# EAGLE design watch super (EAGLE 9.6.2)
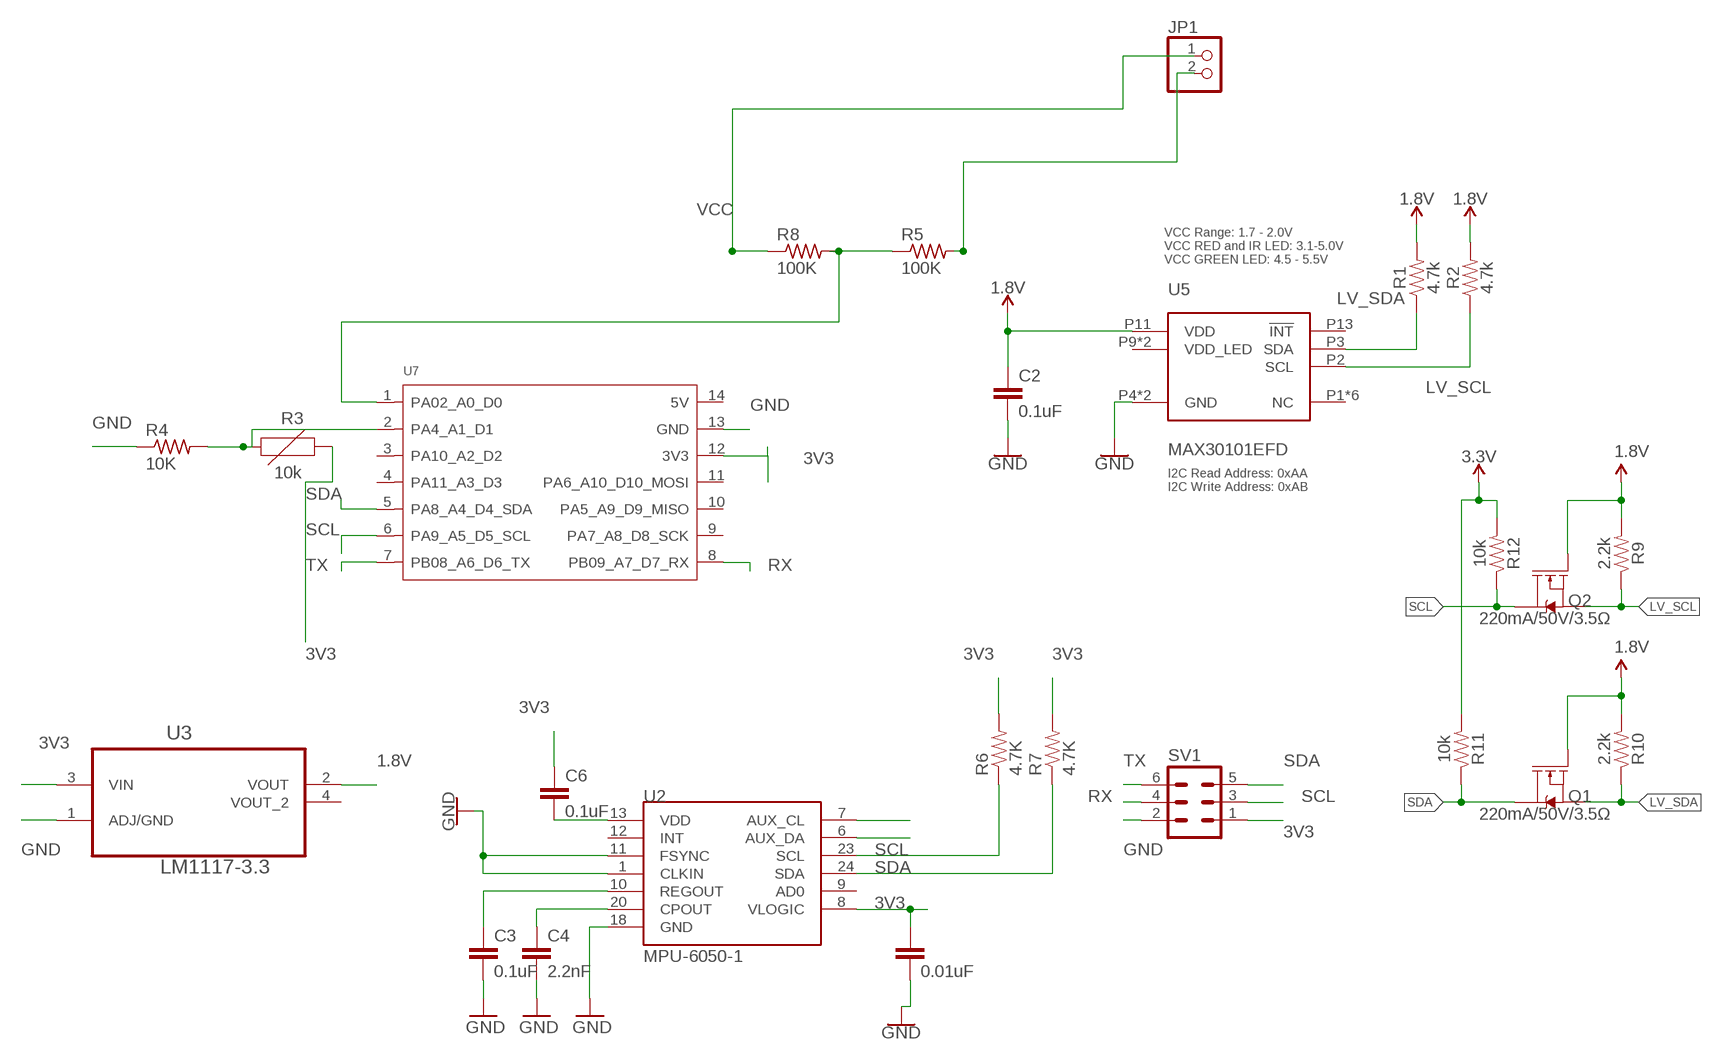
[diagram p0: schematic, sheet 1]

## Parts
0.01UF  0.01uF  CAP0603-CAP  [0603-CAP]
C2  0.1uF  0.1UF-0402-16V-10%  [0402]
C3  0.1uF  CAP0603-CAP  [0603-CAP]
C4  2.2nF  CAP0603-CAP  [0603-CAP]
C6  0.1uF  CAP0603-CAP  [0603-CAP]
JP1  PINHD-1X2  [1X02]
Q1  220mA/50V/3.5Ω  MOSFET-NCH-BSS138  [SOT23-3]
Q2  220mA/50V/3.5Ω  MOSFET-NCH-BSS138  [SOT23-3]
R1  4.7k  4.7KOHM-0603-1/10W-1%  [0603]
R2  4.7k  4.7KOHM-0603-1/10W-1%  [0603]
R3  10k  NTC-THERMISTOR-0603  [0603@1]
R4  10K  R-US_M1206  [M1206]
R5  100K  R-US_R0603  [R0603]
R6  4.7K  RESISTOR0603-RES  [0603-RES]
R7  4.7K  RESISTOR0603-RES  [0603-RES]
R8  100K  R-US_R0603  [R0603]
R9  2.2k  2.2KOHM-0603-1/10W-1%  [0603]
R10  2.2k  2.2KOHM-0603-1/10W-1%  [0603]
R11  10k  10KOHM-0603-1/10W-1%  [0603]
R12  10k  10KOHM-0603-1/10W-1%  [0603]
SV1  MA03-2  [MA03-2]
U2  MPU-6050-1  [QFN-24-4MM2]
U3  LM1117-3.3  [SOT230]
U5  MAX30101EFD  [14_PIN_OESIP]
U7  SEEEDUINOTHT  [MOUDLE14P-2.54-21X17.8MM]

## Nets
1.8V: C2.1 Q1.1(G) Q2.1(G) R1.2 R2.2 R9.2 R10.2 U3.2(VOUT) U5.P11(VDD)
3.3V: R11.2 R12.2
3V3: 0.01UF.1 C6.1 R3.2 R6.2 R7.2 SV1.1 U2.8(VLOGIC) U3.3(VIN) U7.12(3V3)
AUX_SCL: U2.7(AUX_CL)
AUX_SDA: U2.6(AUX_DA)
GND: 0.01UF.2 C2.2 C3.2 C4.2 R4.1 SV1.2 U2.1(CLKIN) U2.11(FSYNC) U2.18(GND) U3.1(ADJ/GND) U5.P4(GND) U5.P12(GND) U7.13(GND)
LV_SCL: Q2.2(S) R2.1 R9.1 U5.P2(SCL)
LV_SDA: Q1.2(S) R1.1 R10.1 U5.P3(SDA)
N$2 [New Class]: R3.1 R4.2 U7.2(PA4_A1_D1)
N$3: JP1.2 R5.2
N$4: C4.1 U2.20(CPOUT)
N$5: C3.1 U2.10(REGOUT)
N$7: C6.2 U2.13(VDD)
N$9: R5.1 R8.2 U7.1(PA02_A0_D0)
RX: SV1.4 U7.8(PB09_A7_D7_RX)
SCL: Q2.3(D) R6.1 R12.1 SV1.3 U2.23(SCL) U7.6(PA9_A5_D5_SCL)
SDA: Q1.3(D) R7.1 R11.1 SV1.5 U2.24(SDA) U7.5(PA8_A4_D4_SDA)
TX: SV1.6 U7.7(PB08_A6_D6_TX)
VCC: JP1.1 R8.1
Unconnected: U2.9(AD0) U2.12(INT) U3.4(VOUT_2) U5.P1(NC) U5.P5(NC) U5.P6(NC) U5.P7(NC) U5.P8(NC) U5.P13(!INT) U5.P14(NC) U7.3(PA10_A2_D2) U7.4(PA11_A3_D3) U7.9(PA7_A8_D8_SCK) U7.10(PA5_A9_D9_MISO) U7.11(PA6_A10_D10_MOSI) U7.14(5V)

## Notes on the sheet
- VCC Range: 1.7 - 2.0V
  VCC RED and IR LED: 3.1-5.0V
  VCC GREEN LED: 4.5 - 5.5V
- I2C Read Address: 0xAA
  I2C Write Address: 0xAB

## Power pins joined to a net without a drawn wire
VDD_LED: U5.P9(VDD_LED) U5.P10(VDD_LED)

## Library data of the parts
0.01UF C3 C4 C6 = SparkFun:CAP: Capacitor Standard 0603 ceramic capacitor, and 0.1" leaded capacitor.
C2 = SparkFun-Capacitors:0.1UF: 0.1µF ceramic capacitors A capacitor is a passive two-terminal electrical component used to store electrical energy temporarily in an electric field.; PROD_ID: CAP-12416
JP1 = pinhead:PINHD-1X2: PIN HEADER
Q1 Q2 = SparkFun-DiscreteSemi:MOSFET-NCH: N-channel MOSFETs Voltage controlled devices that allow control of high current outputs. SparkFun Products: SparkFun OpenScale <https://www.sparkfun.com/products/13261> SparkFun Digital Sandbox <https://www.sparkfun.com/products/12651> SparkFun Monster Moto Shield <https://www.sparkfun.com/products/10182> SparkFun MOSFET Power Controller <https://www.sparkfun.com/products/11214>; PROD_ID: TRANS-00830
R1 R2 = SparkFun-Resistors:4.7KOHM: 4.7kΩ resistor A resistor is a passive two-terminal electrical component that implements electrical resistance as a circuit element. Resistors act to reduce current flow, and, at the same time, act to lower voltage levels within circuits. - Wikipedia; PROD_ID: RES-07857
R3 = SparkFun-Resistors:NTC-THERMISTOR: NTC Thermistor An NTC thermistor's resistance decreases as temperature rises. Applications: Resistance Thermometer - temperature monitoring Inrush current limiter Heat source; PROD_ID: RES-13608
R4 = adafruit:R-US_: RESISTOR, American symbol
R5 R8 = rcl:R-US_: RESISTOR, American symbol; SPICEPREFIX: R
R6 R7 = SparkFun:RESISTOR: Resistor Basic schematic elements and footprints for 0603, 1206, and PTH resistors.
R9 R10 = SparkFun-Resistors:2.2KOHM: 2.2kΩ resistor A resistor is a passive two-terminal electrical component that implements electrical resistance as a circuit element. Resistors act to reduce current flow, and, at the same time, act to lower voltage levels within circuits. - Wikipedia; PROD_ID: RES-08272
R11 R12 = SparkFun-Resistors:10KOHM: 10kΩ resistor A resistor is a passive two-terminal electrical component that implements electrical resistance as a circuit element. Resistors act to reduce current flow, and, at the same time, act to lower voltage levels within circuits. - Wikipedia; PROD_ID: RES-00824
SV1 = con-lstb:MA03-2: PIN HEADER; OC_FARNELL: unknown; OC_NEWARK: unknown
U2 = Testing:MPU-6050
U3 = LM1117-3.3:LM1117-3.3: IC REG LDO 800MA 3.3V Check availability <https://pricing.snapeda.com/parts/LM1117-3.3/Texas%20Instruments/view-part?ref=eda>; AVAILABILITY: Not in stock; CHECK_PRICES: https://www.snapeda.com/parts/LM1117-3.3/Texas+Instruments/view-part/?ref=eda; DESCRIPTION: Linear Voltage Regulator IC Positive Fixed 1 Output 800mA DDPAK/TO-263-3; MF: Texas Instruments; MP: LM1117-3.3; PACKAGE: None; PRICE: None; SNAPEDA_LINK: https://www.snapeda.com/parts/LM1117-3.3/Texas+Instruments/view-part/?ref=snap
U5 = SparkFun-IC-Special-Function:MAX30101EFD: MAX30101 High-Sensitivity Pulse Oximeter and Heart-Rate Sensor The MAX30101 is an integrated pulse oximetry and heart-rate monitor module. It includes internal LEDs, photodetectors, optical elements, and low-noise electronics with ambient light rejection. The MAX30101 provides a complete system solution to ease the design-in process for mobile and wearable devices. The MAX30101 operates on a single 1.8V power supply and a separate 5.0V power supply for the internal LEDs. Communication is through a standard I2C-compatible interface. The module can be shut down through software with zero standby current, allowing the power rails to remain powered at all times; PROD_ID: IC-14270
U7 = Seeed-Studio-XIAO-ESP32C3-footprint-eagle:SEEEDUINOTHT

## Net classes
1 New Class: width 0.015 mm

## Board
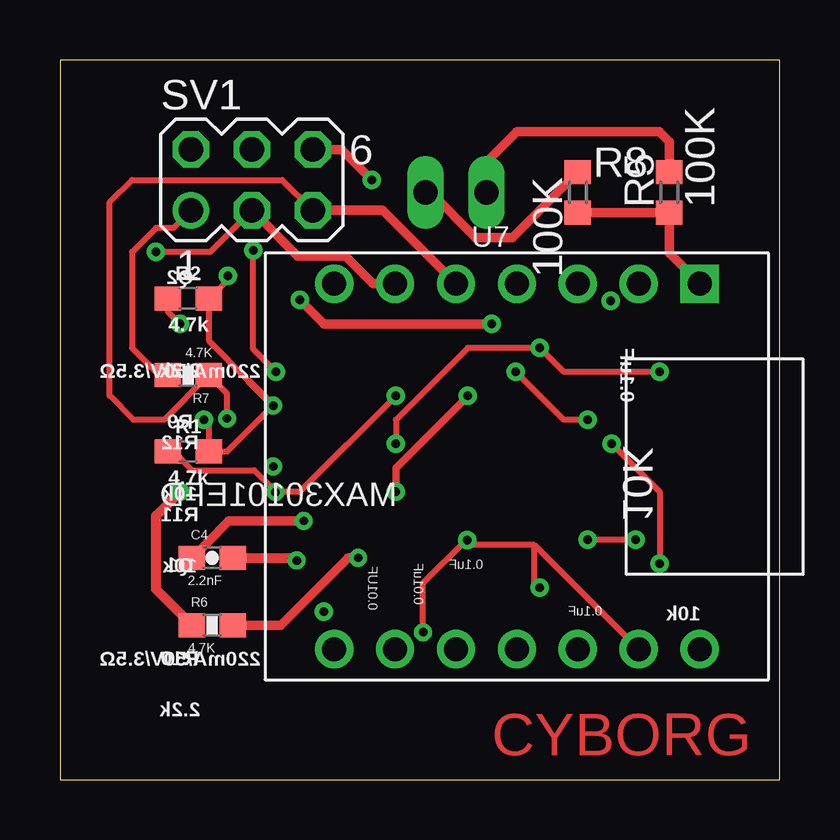
[diagram p1: board, top side]
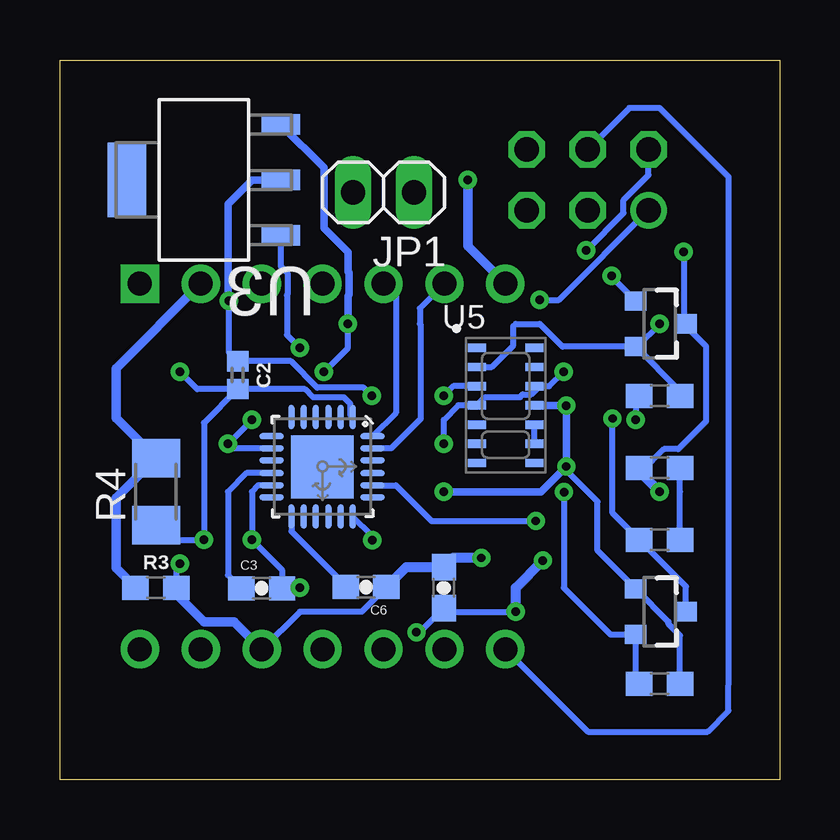
[diagram p2: board, bottom side, seen from below]

Size 30 x 30 mm. Coordinates in mm from the lower left corner, seen from the top.
Outline: 0,0 30,0 30,30 0,30 0,0
Copper layers (1*16): Top 0.035mm / dielectric 1.5mm / Bottom 0.035mm
Design rules "default": minimum track width 6mil, minimum drill 0.35mm, track to track 6mil, track to pad 6mil, pad to pad 6mil, via to via 6mil, smd to smd 6mil, copper to edge 40mil, drill to drill 6mil, minimum pad ring 10mil, minimum via ring 8mil, stop-mask expansion 4mil, vias tented up to drill 0mil, thermal gap 10mil

### Footprints (pad centres in the part's own frame; a part is rotated, then mirrored left to right if it is on the bottom)
0603-CAP = smd 1.1 x 1: 1 -0.85,0; 2 0.85,0
0402 = smd 0.85 x 0.9: 1 -0.58,0; 2 0.58,0
1X02 = drill 1.016 long: 1 -1.27,0; 2 1.27,0
SOT23-3 = smd 0.8 x 0.9: 1 -0.95,-1; 2 0.95,-1; 3 0,1.1
0603 = smd 1.1 x 1: 1 -0.85,0; 2 0.85,0
0603@1 = smd 1.1 x 1: 1 -0.85,0; 2 0.85,0
M1206 = smd 1.6 x 2: 1 -1.4,0; 2 1.4,0
R0603 = smd 1 x 1.1: 1 -0.85,0; 2 0.85,0
0603-RES = smd 1.1 x 1: 1 -0.85,0; 2 0.85,0
MA03-2 = drill 1.016: 1 -2.54,-1.27 | drill 1.016 octagon: 2 -2.54,1.27; 3 0,-1.27; 4 0,1.27; 5 2.54,-1.27; 6 2.54,1.27
QFN-24-4MM2 = smd 1.016 x 0.254: 1 -2.066,1.257; 2 -2.066,0.75; 3 -2.066,0.247; 4 -2.066,-0.287; 5 -2.066,-0.792; 6 -2.066,-1.297; 13 2.086,-1.297; 14 2.086,-0.792; 15 2.086,-0.287; 16 2.086,0.247; 17 2.086,0.75; 18 2.086,1.257 | smd 0.254 x 1.016: 7 -1.267,-2.122; 8 -0.762,-2.122; 9 -0.258,-2.122; 10 0.278,-2.122; 11 0.78,-2.122; 12 1.287,-2.122; 19 1.287,2.082; 20 0.78,2.082; 21 0.278,2.082; 22 -0.258,2.082; 23 -0.762,2.082; 24 -1.267,2.082 | smd 2.616 x 2.616: P$1 0.02,-0.01
SOT230 = smd 1.6 x 0.838: 1 -3.2,2.311; 2 -3.2,0; 3 -3.2,-2.311 | smd 1.6 x 3.099: 4 3.2,0
14_PIN_OESIP = smd 0.75 x 0.35: P1 -1.193,2.409; P2 -1.193,1.609; P3 -1.193,0.809; P4 -1.193,0.009; P5 -1.193,-0.791; P6 -1.193,-1.591; P7 -1.193,-2.391; P8 1.207,-2.391; P9 1.207,-1.591; P10 1.207,-0.791; P11 1.207,0.009; P12 1.207,0.809; P13 1.207,1.609; P14 1.207,2.409
MOUDLE14P-2.54-21X17.8MM = drill 1 pad 1.6 square: 1 7.62,7.62 | drill 1 pad 1.6: 2 5.08,7.62; 3 2.54,7.62; 4 0,7.62; 5 -2.54,7.62; 6 -5.08,7.62; 7 -7.62,7.62; 8 -7.62,-7.62; 9 -5.08,-7.62; 10 -2.54,-7.62; 11 0,-7.62; 12 2.54,-7.62; 13 5.08,-7.62; 14 7.62,-7.62

### Placement (x,y rotation side)
0.01UF  14,8 270 bottom
C2  22.59,16.86 270 bottom
C3  21.59,7.97 0 bottom
C4  6.35,9.24 0 top
C6  17.24,8.03 180 bottom
JP1  16.51,24.48 180 bottom
Q1  5,7 270 bottom
Q2  5,19 270 bottom
R1  5.35,13.67 0 top
R2  5.35,20.05 0 top
R3  26,8 0 bottom
R4  26,12 90 bottom
R5  25.4,24.48 90 top
R6  6.35,6.43 0 top
R7  5.35,16.86 180 top
R8  21.59,24.48 270 top
R9  5,16 180 bottom
R10  5,4 0 bottom
R11  5,10 0 bottom
R12  5,13 0 bottom
SV1  8,25 0 top
U2  19.05,13.05 270 bottom
U3  24,25 180 bottom
U5  11.43,15.59 0 bottom
U7  19.05,13.05 0 top

### Tracks (layer width: path | path; a pad name or v marks a point on that pad's centre or on a via)
1.8V  (via drill 0.35)
  Top 0.254: 7.89,16.59 7.03,17.45 7.03,17.48 6.2,18.3 R2.2 7,20.85 v7,21 | v8.89,15.59 6.97,13.67 R1.2 6.2,14.8 v6,15
  Top 0.305: v17,16 14,13 v14,12 | 7.89,16.59 v8.89,15.59
  Bottom 0.254: R10.2 4.15,6.01 4.63,6.48 4.63,6.58 Q1.1 7.59,9.54 7.59,11.59 8.97,12.97 | Q2.1 7,20.95 v7,21 | R9.2 6,15.85 v6,15 | v17,16 17.34,16.34 19.27,16.34 20.37,17.44 C2.1 22.96,17.81 v22.96,19.96
  Bottom 0.305: U3.2 22,25 23,24 23,20 v22.96,19.96 | v14,12 9.94,12 8.97,12.97 v8.89,13.05 v8.89,15.59 | v8.9,15.6 U5.P11
  Bottom 0.4: v8.89,15.59 v8.9,15.6
3.3V
  Bottom 0.254: R11.2 4.15,12 R12.2
3V3  (via drill 0.35)
  Top 0.254: SV1.1 4.73,23 4,23 3,22 3,18 4.14,16.86 R7.2 | v23,14 25,12 v25,9 | v22,15 21,15 v19,17
  Top 0.4: v12.43,9.24 12.01,9.24 9.2,6.43 R6.2 | v18,19 11,19 v10,20 | SV1.1 5.46,23.46
  Bottom 0.254: C6.1 17.42,7 20,7 21.57,5.43 U7.12 | v10,20 9.19,20 SV1.1 | U2.8 22.81,13.81 v23,14 v22,15 | v25,9 25.15,8.85 R3.2 | v19,17 18,18 v18,19
  Bottom 0.305: v18,19 18,20.16 17.95,20.21 17.95,21.13 18,21.18 18,22 19,23 19,25.51 U3.3
  Bottom 0.4: U7.12 22.74,6.58 24,6.58 25.15,7.73 R3.2
  Bottom 0.406: v12.43,9.24 13.61,9.24 0.01UF.1 15.57,8.85 C6.1
  other vias: 21.59,5.43 5.46,23.73
GND  (via drill 0.35)
  Top 0.254: v24,10 v22,10 | 19.78,9.78 U7.13 | v25,17 21,17 v20,18 17,18 14,15 v14,14 | v9,17 8.06,17.94 v8.06,22.06 | 16.95,10 15.14,8.19 v15.14,6.14 | 19.78,9.78 17.17,9.78 v16.98,9.98 | v20,8 19.78,8.22 19.78,9.78
  Top 0.406: C4.2 9.76,9.24 v9.87,9.13 | 16.95,10 v16.98,9.98
  Bottom 0.254: R4.1 25.4,10 v24,10 24,14.87 C2.2 | 12.61,15.61 12.28,15.94 12.13,15.94 10.82,15.94 10.71,16.05 10.35,16.05 10,16.4 | 12.61,15.61 U5.P4 | v11,7 13.85,7 0.01UF.2 15.01,6.14 v15.14,6.14 | U2.11 21.73,12.27 22,12 v22,10 20.74,8.74 C3.2 20.71,8 v20,8 | U2.1 17.89,15.22 17.89,15.67 18.16,15.94 19.44,15.94 19.79,16.28 C2.2 | v20,18 20.54,18.54 20.54,20.2 20.51,20.22 20.51,21.12 20.8,21.41 U3.1 | C2.2 24.28,16.28 v25,17 | U5.P12 10,16.4 | 10,16.4 9.6,16.4 v9,17 | v8.06,22.06 6.5,23.62 6.5,24.16 5.46,25.2 SV1.2 | v16.98,9.98 16.98,10.15 U2.18 | v14,14 14,15 13.39,15.61 12.61,15.61
  Bottom 0.406: v11,7 11,8 v9.87,9.13
LV_SCL  (via drill 0.35)
  Top 0.254: R2.1 4.5,19.5 v5,19
  Bottom 0.254: Q2.2 9.05,18.05 10,19 11,19 11.1,18.9 11.1,18.1 12,17.2 U5.P2 | v5,19 5.95,18.05 Q2.2 | R9.1 4.15,16.2 Q2.2
LV_SDA  (via drill 0.35)
  Top 0.254: v14,16 9.99,11.99 v9,11.99 | v9,11.99 v8.99,11.99 | R1.1 4.75,13.67 5.53,12.89 8.1,12.89 v9,11.99
  Bottom 0.254: R10.1 6,4.15 Q1.2 7.05,6.05 9,8 9,11.97 v8.99,11.99 | U5.P3 13.6,16.4 v14,16
N$2
  Bottom 0.4: R3.1 26.93,8.07 27,8.15 27.66,8.81 27.66,11.74 R4.2 27.66,15.06 27.66,17.14 U7.2
N$3
  Top 0.4: JP1.2 17.78,25.75 19.05,27.02 24.98,27.02 25.4,26.6 R5.2
N$4  (via drill 0.35)
  Top 0.4: C4.1 6.13,9.87 7.04,10.78 v10.16,10.78
  Bottom 0.254: U2.20 16,12.27 14.51,10.78 v10.16,10.78
N$5
  Bottom 0.254: U2.10 22.23,12.77 23,12 23,8.53 C3.1
N$7
  Bottom 0.254: U2.13 20.35,10.35 18.09,8.09 C6.2
N$9
  Top 0.4: U7.1 25.4,21.94 R5.1 R8.2
RX
  Bottom 0.254: U7.8 8,2 3,2 2.13,2.87 2.12,5 2.12,25.12 5,28 6.27,28 SV1.4
SCL  (via drill 0.35)
  Top 0.254: v4,22 6.27,22 SV1.3
  Top 0.4: U7.6 13.06,20.67 11.91,21.82 9.91,21.82 SV1.3
  Top 0.406: R6.1 4,7.93 4,11 v5,12
  Bottom 0.254: U7.6 15,19.64 15,19 14.97,18.97 14.97,15.03 16.19,13.81 U2.23 | v4,22 4,19.1 Q2.3 3.9,18.9 3.06,18.06 3.06,14.94 4.22,13.78 4.82,13.78 5.75,12.85 5.85,12.85
  Bottom 0.406: v5,12 5.85,12.85 R12.1
SDA  (via drill 0.35)
  Top 0.254: v6.96,15.05 6.96,16.1 R7.1 4.34,15 3.07,15 2.07,16 2.07,24.07 3,25 9.27,25 SV1.5
  Top 0.4: SV1.5 13.45,23.73 U7.5
  Top 0.406: SV1.5 10.27,23.73
  Bottom 0.254: U7.5 16,20.16 16,15.29 U2.24 | Q1.3 3.9,8.05 R11.1 6.96,11.11 v6.96,15.05
  other vias: 16.51,20.67
TX  (via drill 0.35)
  Top 0.4: SV1.6 11.73,26.27 v13,25
  Bottom 0.4: v13,25 13,22.24 U7.7
VCC
  Top 0.4: JP1.1 15.44,24.48 17.32,22.6 18.86,22.6 R8.1
VDD_LED
  Bottom 0.254: U5.P9 U5.P10

### Text on the board
Top: CYBORG